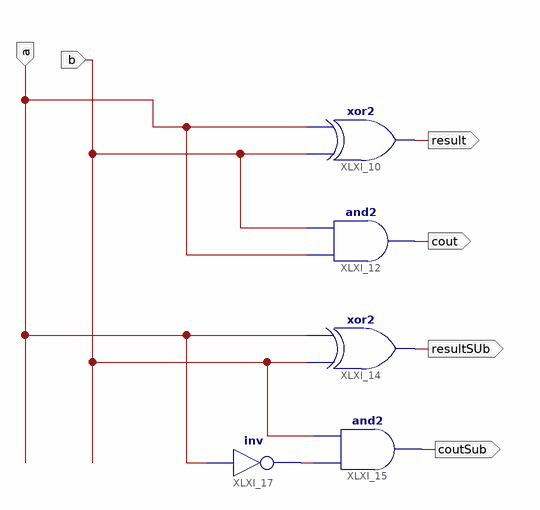
[diagram p0: schematic sheet 1]
// Xilinx ISE schematic SchematicFile.sch (spartan3e) as structural Verilog: 5 symbols, 6 ports
module SchematicFile (
  input  b,
  input  a,
  output result,
  output cout,
  output coutSub,
  output resultSUb
);

  wire XLXN_9;

  xor XLXI_10 (result, b, a);
  and XLXI_12 (cout, a, b);
  xor XLXI_14 (resultSUb, b, a);
  and XLXI_15 (coutSub, XLXN_9, b);
  not XLXI_17 (XLXN_9, a);
endmodule
